# EAGLE design SoundBoard (EAGLE 8.3.0)
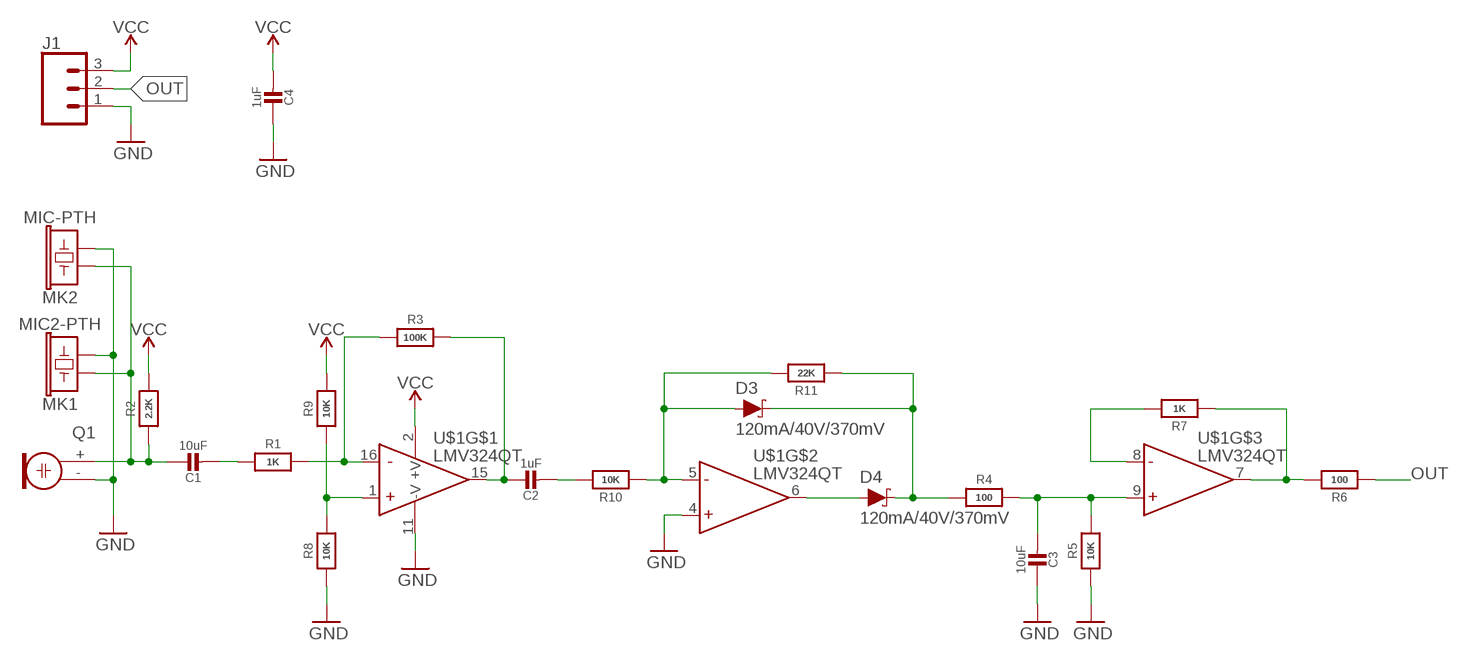
[diagram p0: schematic, sheet 1]

## Parts
C1  10uF  MICROBUILDER_CAP_CERAMIC_0402MP  [MICROBUILDER__0402MP]
C2  1uF  MICROBUILDER_CAP_CERAMIC_0402MP  [MICROBUILDER__0402MP]
C3  10uF  MICROBUILDER_CAP_CERAMIC_0402MP  [MICROBUILDER__0402MP]
C4  1uF  MICROBUILDER_CAP_CERAMIC_0402MP  [MICROBUILDER__0402MP]
D3  120mA/40V/370mV  DIODE-SCHOTTKY-RB751S40  [SOD-523]
D4  120mA/40V/370mV  DIODE-SCHOTTKY-RB751S40  [SOD-523]
J1  CONN_03  [1X03]
MK1  MIC2-PTH  [MICROPHONE-PTH-4.0MM]
MK2  MIC-PTH  [MICROPHONE-PTH-4.0MM]
Q1  ELECTRET  [9.7ELECTRET]
R1  1K  MICROBUILDER_RESISTOR_0402MP  [MICROBUILDER__0402MP]
R2  2.2K  MICROBUILDER_RESISTOR_0402MP  [MICROBUILDER__0402MP]
R3  100K  MICROBUILDER_RESISTOR_0402MP  [MICROBUILDER__0402MP]
R4  100  MICROBUILDER_RESISTOR_0402MP  [MICROBUILDER__0402MP]
R5  10K  MICROBUILDER_RESISTOR_0402MP  [MICROBUILDER__0402MP]
R6  100  MICROBUILDER_RESISTOR_0402MP  [MICROBUILDER__0402MP]
R7  1K  MICROBUILDER_RESISTOR_0402MP  [MICROBUILDER__0402MP]
R8  10K  MICROBUILDER_RESISTOR_0402MP  [MICROBUILDER__0402MP]
R9  10K  MICROBUILDER_RESISTOR_0402MP  [MICROBUILDER__0402MP]
R10  10K  MICROBUILDER_RESISTOR_0402MP  [MICROBUILDER__0402MP]
R11  22K  MICROBUILDER_RESISTOR_0402MP  [MICROBUILDER__0402MP]
U$1  LMV324QT  [QFN-16_3X3]

## Nets
_OUT: R6.2 R7.1 U$1.7(OUT)
AMP: C2.1 R3.2 U$1.15(OUT)
GND: C3.1 C4.1 J1.1 MK1.GND MK2.GND Q1.- R5.1 R8.1 U$1.4(+IN) U$1.11(-V)
N$1: C1.2 R1.1
N$2: R1.2 R3.1 U$1.16(-IN)
N$4: D4.A U$1.6(OUT)
N$5: R7.2 U$1.8(-IN)
N$6: D3.A R10.1 R11.2 U$1.5(-IN)
N$7: D3.C D4.C R4.1 R11.1
N$8: C2.2 R10.2
N$9: C3.2 R4.2 R5.2 U$1.9(+IN)
N$10: C1.1 MK1.OUT MK2.OUT Q1.+ R2.1
OUT: J1.2 R6.1
VCC: C4.2 J1.3 R2.2 R9.2 U$1.2(+V)
VCC/2: R8.2 R9.1 U$1.1(+IN)
Unconnected: U$1.12(+IN) U$1.13(-IN) U$1.14(OUT)

## Library data of the parts
C1-C4 = Adafruit Feather 32u4 Bluefruit LE:MICROBUILDER_CAP_CERAMIC: Ceramic Capacitors For new designs, use the packages preceded by an '_' character since they are more reliable: The following footprints should be used on most boards: _0402 - Standard footprint for regular board layouts _0603 - Standard footprint for regular board layouts _0805 - Standard footprint for regular board layouts _1206 - Standard footprint for regular board layouts For extremely tight-pitch boards where space is at a premium, the following 'micro-pitch' footprints can be used (smaller pads, no silkscreen outline, etc.): _0402MP - Micro-pitch footprint for very dense/compact boards _0603MP - Micro-pitch footprint for very dense/compact boards _0805MP - Micro-pitch footprint for very dense/compact boards _1206MP - Micro-pitch footprint for very dense/compact boards
D3 D4 = SparkFun-DiscreteSemi:DIODE-SCHOTTKY: Schottky diode A Schottky diode is a semiconductor diode which has a low forward voltage drop and a very fast switching action.; PROD_ID: DIO-11018
J1 = SparkFun-Connectors:CONN_03: Multi connection point. Often used as Generic Header-pin footprint for 0.1 inch spaced/style header connections On any of the 0.1 inch spaced packages, you can populate with these: Break Away Headers - Straight <https://www.sparkfun.com/products/116> (PRT-00116) Break Away Male Headers - Right Angle <https://www.sparkfun.com/products/553> (PRT-00553) Female Headers <https://www.sparkfun.com/products/115> (PRT-00115) Break Away Headers - Machine Pin <https://www.sparkfun.com/products/117> (PRT-00117) Break Away Female Headers - Swiss Machine Pin <https://www.sparkfun.com/products/743> (PRT-00743) Stackable Header - 3 Pin (Female, 0.1") <https://www.sparkfun.com/products/13875> (PRT-13875) For SCREWTERMINALS and SPRING TERMINALS visit here: Screw Terimnals on SparkFun.com <https://www.sparkfun.com/search/results?term=Screw+Terminals> (5mm/3.5mm/2.54mm spacing) This device is also useful as a general connection point to wire up your design to another part of your project. Our various solder wires solder well into these plated through hole pads. Hook-Up Wire - Assortment (Stranded, 22 AWG) <https://www.sparkfun.com/products/11375> (PRT-11375) Hook-Up Wire - Assortment (Solid Core, 22 AWG) <https://www.sparkfun.com/products/11367> (PRT-11367) View the entire wire category on our website here <https://www.sparkfun.com/categories/141> Special notes: Molex polarized connector foot print use with SKU : PRT-08232 with associated crimp pins and housings.
MK1 = CMC-4015-40P:MIC2: Mini Electret Microphone Omni-directional electret microphone. MPN: CMC-4015-40P; PROD_ID: COMP-08856; SF_ID: COM-08635
MK2 = TOM-1545P-R:MIC: Mini Electret Microphone Omni-directional electret microphone. MPN: TOM-1545P-R Datasheet <http://www.puiaudio.com/pdf/TOM-1545P-R.pdf>; PROD_ID: COMP-08856; SF_ID: COM-08635
Q1 = adafruit:ELECTRET: Electret microphone Thru hole 2.54mm spacing with 9.7mm diameter
R1-R11 = Adafruit PowerBoost 1000C Rev B:MICROBUILDER_RESISTOR: Resistors For new designs, use the packages preceded by an '_' character since they are more reliable: The following footprints should be used on most boards: _0402 - Standard footprint for regular board layouts _0603 - Standard footprint for regular board layouts _0805 - Standard footprint for regular board layouts _1206 - Standard footprint for regular board layouts For extremely tight-pitch boards where space is at a premium, the following 'micro-pitch' footprints can be used (smaller pads, no silkscreen outline, etc.): _0402MP - Micro-pitch footprint for very dense/compact boards _0603MP - Micro-pitch footprint for very dense/compact boards _0805MP - Micro-pitch footprint for very dense/compact boards _1206MP - Micro-pitch footprint for very dense/compact boards
U$1 = LMV324:LMV324QT

## Board
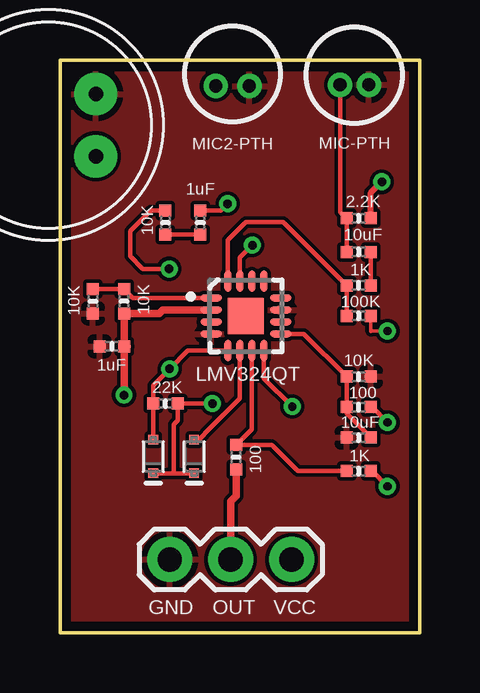
[diagram p1: board, top side]
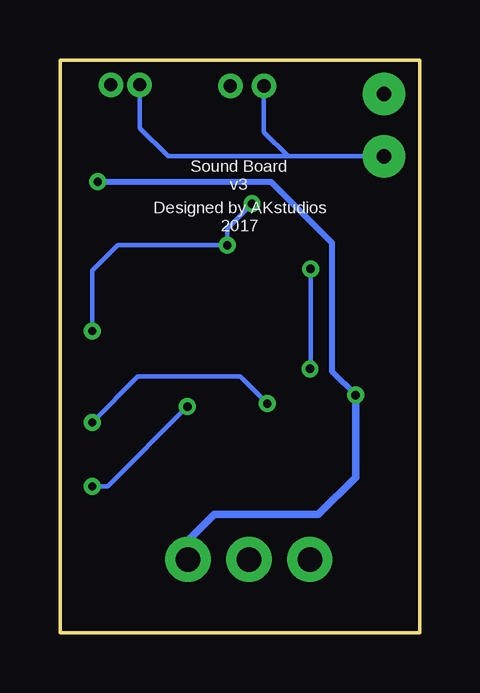
[diagram p2: board, bottom side, seen from below]

Size 14.99 x 23.88 mm. Coordinates in mm from the lower left corner, seen from the top.
Outline: 0,0 0,23.88 14.99,23.88 14.99,0 0,0
Copper layers (1*16): Top 0.0356mm / dielectric 1.5011mm / Bottom 0.0356mm
Design rules "oshpark-2layer": minimum track width 6mil, minimum drill 13mil, track to track 6mil, track to pad 6mil, pad to pad 6mil, via to via 6mil, smd to smd 6mil, copper to edge 15mil, drill to drill 6mil, minimum pad ring 7mil, minimum via ring 7mil, stop-mask expansion 2.5mil, vias tented up to drill 0mil, thermal gap 10mil

### Footprints (pad centres in the part's own frame; a part is rotated, then mirrored left to right if it is on the bottom)
MICROBUILDER__0402MP = smd 0.5 x 0.5: 1 -0.508,0; 2 0.508,0
SOD-523 = smd 0.4 x 0.4: A -0.7,0; C 0.7,0
1X03 = drill 1.016 pad 1.88: 1 0,0; 2 2.54,0; 3 5.08,0
MICROPHONE-PTH-4.0MM = drill 0.55 pad 1.016: GND -0.7,0.5; OUT 0.7,0.5
MICROPHONE-PTH-4.0MM' = drill 0.55 pad 1.016: GND -0.6,0.4; OUT 0.6,0.4
9.7ELECTRET = drill 0.6 pad 1.778: + 1.3,2; - -1.3,2
QFN-16_3X3 = smd 0.9 x 0.3: 1 -1.45,0.75; 2 -1.45,0.25; 3 -1.45,-0.25; 4 -1.45,-0.75; 9 1.45,-0.75; 10 1.45,-0.25; 11 1.45,0.25; 12 1.45,0.75 | smd 0.3 x 0.9: 5 -0.75,-1.45; 6 -0.25,-1.45; 7 0.25,-1.45; 8 0.75,-1.45; 13 0.75,1.45; 14 0.25,1.45; 15 -0.25,1.45; 16 -0.75,1.45 | smd 1.5 x 1.5: 17 0,0

### Placement (x,y rotation side)
C1  12.45,15.88 0 top
C2  5.84,17.09 270 top
C3  12.45,8.13 0 top
C4  2.16,11.94 0 top
D3  3.89,7.34 270 top
D4  5.59,7.34 270 top
J1  4.57,3.05 0 top
MK1  7.19,23.29 180 top
MK2  MIC-PTH  [MICROPHONE-PTH-4.0MM']  12.27,23.24 180 top
Q1  -0.51,21.16 270 top
R1  12.45,14.48 180 top
R2  12.45,17.27 0 top
R3  12.45,13.21 0 top
R4  12.45,9.4 180 top
R5  12.45,10.67 180 top
R6  7.34,7.32 90 top
R7  12.45,6.73 0 top
R8  1.37,13.82 90 top
R9  2.67,13.82 270 top
R10  4.39,17.09 270 top
R11  4.39,9.55 180 top
U$1  7.75,13.21 0 top

### Tracks (layer width: path | path; a pad name or v marks a point on that pad's centre or on a via)
_OUT
  Top 0.178: R7.1 9.91,6.73 8.81,7.82 R6.2 8,8.48 U$1.7
AMP  (via drill 0.35)
  Top 0.152: R3.2 12.95,12.56 12.97,12.57 v13.64,12.57
  Top 0.178: U$1.15 7.5,15.64 v8.01,16.15 | C2.1 6.71,17.6 v6.98,17.88
  Bottom 0.178: v13.64,12.57 13.64,15.09 12.57,16.15 v8.01,16.15 8.01,16.85 v6.98,17.88
GND
  pour Top: -0.51,-0.76 -0.51,24.51 15.49,24.51 15.49,-0.76
N$1
  Top 0.178: C1.2 R1.1
N$2
  Top 0.178: R3.1 R1.2 9.3,17.12 7.75,17.12 7,16.37 U$1.16
N$4
  Top 0.178: U$1.6 7.5,9.76 6.26,8.53 | 6.26,8.53 6.22,8.48 | D4.A 5.78,8.04 6.26,8.53
N$5  (via drill 0.35)
  Top 0.178: U$1.8 8.5,10.6 v9.68,9.42 | R7.2 13.01,6.73 v13.64,6.1
  Bottom 0.178: v13.64,6.1 13,6.1 v9.68,9.42
N$6  (via drill 0.35)
  Top 0.178: D3.A R11.2 3.89,10.31 4.13,10.56 | U$1.5 5.33,11.76 v4.57,10.99 4.13,10.56 | 4.13,10.56 4.12,10.54 | R10.1 3.78,17.6 2.92,16.74 2.92,15.7 3.45,15.16 v4.55,15.16
  Bottom 0.178: v4.55,15.16 4.55,11.02 v4.57,10.99
N$7  (via drill 0.35)
  Top 0.178: R4.1 13.01,9.4 v13.64,8.76 | v6.35,9.55 R11.1 4.9,8.84 4.75,8.69 4.75,6.66 4.73,6.64 | 4.73,6.64 D4.C | 4.73,6.64 D3.C
  Bottom 0.178: v6.35,9.55 7.47,10.67 11.74,10.67 v13.64,8.76
N$8
  Top 0.178: C2.2 R10.2
N$9
  Top 0.178: U$1.9 10.15,12.46 R5.2 R4.2 11.94,9.14 C3.2
N$10
  Top 0.178: C1.1 R2.1 11.67,17.54 MK2.OUT
  Bottom 0.178: Q1.+ 3.56,19.86 5.48,19.86 | MK1.OUT 6.49,20.87 5.48,19.86 | MK2.OUT 11.67,21.04 10.49,19.86 5.48,19.86
OUT
  Top 0.305: 7.34,5.69 R6.1 | 7.34,5.69 7.24,5.59 | J1.2 7.11,5.46 7.34,5.69
VCC  (via drill 0.35)
  Top 0.254: R2.2 12.95,18.34 v13.41,18.8
  Top 0.305: v2.67,9.9 C4.2 | 2.8,11.94 C4.2 | C4.2 R9.2 4.14,13.31 4.29,13.46 U$1.2
  Bottom 0.254: v13.41,18.8 6.2,18.8 3.66,16.26 3.66,10.89 v2.67,9.9
  Bottom 0.305: J1.3 9.65,3.83 8.56,4.93 4.22,4.93 2.67,6.48 v2.67,9.9
VCC/2
  Top 0.178: R8.2 R9.1 3.03,13.96 U$1.1

### Text on the board
tPlace: GND | OUT | VCC
bPlace: Sound Board / v3 | Designed by AKstudios / 2017